# EAGLE schematic 00-eagleClass-00-battery (EAGLE 7.6.0)
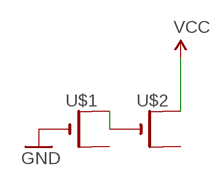
[diagram p0: schematic, sheet 1]

## Parts
U$1  CR2032THM  [CR2032-THRU]
U$2  CR2032THM  [CR2032-THRU]

## Nets
GND: U$1.-
N$4: U$1.+1(+) U$2.-
VCC: U$2.+1(+)
Unconnected: U$1.+2(+1) U$2.+2(+1)

## Library data of the parts
U$1 U$2 = adafruit:CR2032